# EAGLE design DonkeyBackpackM2R (EAGLE 5.11)
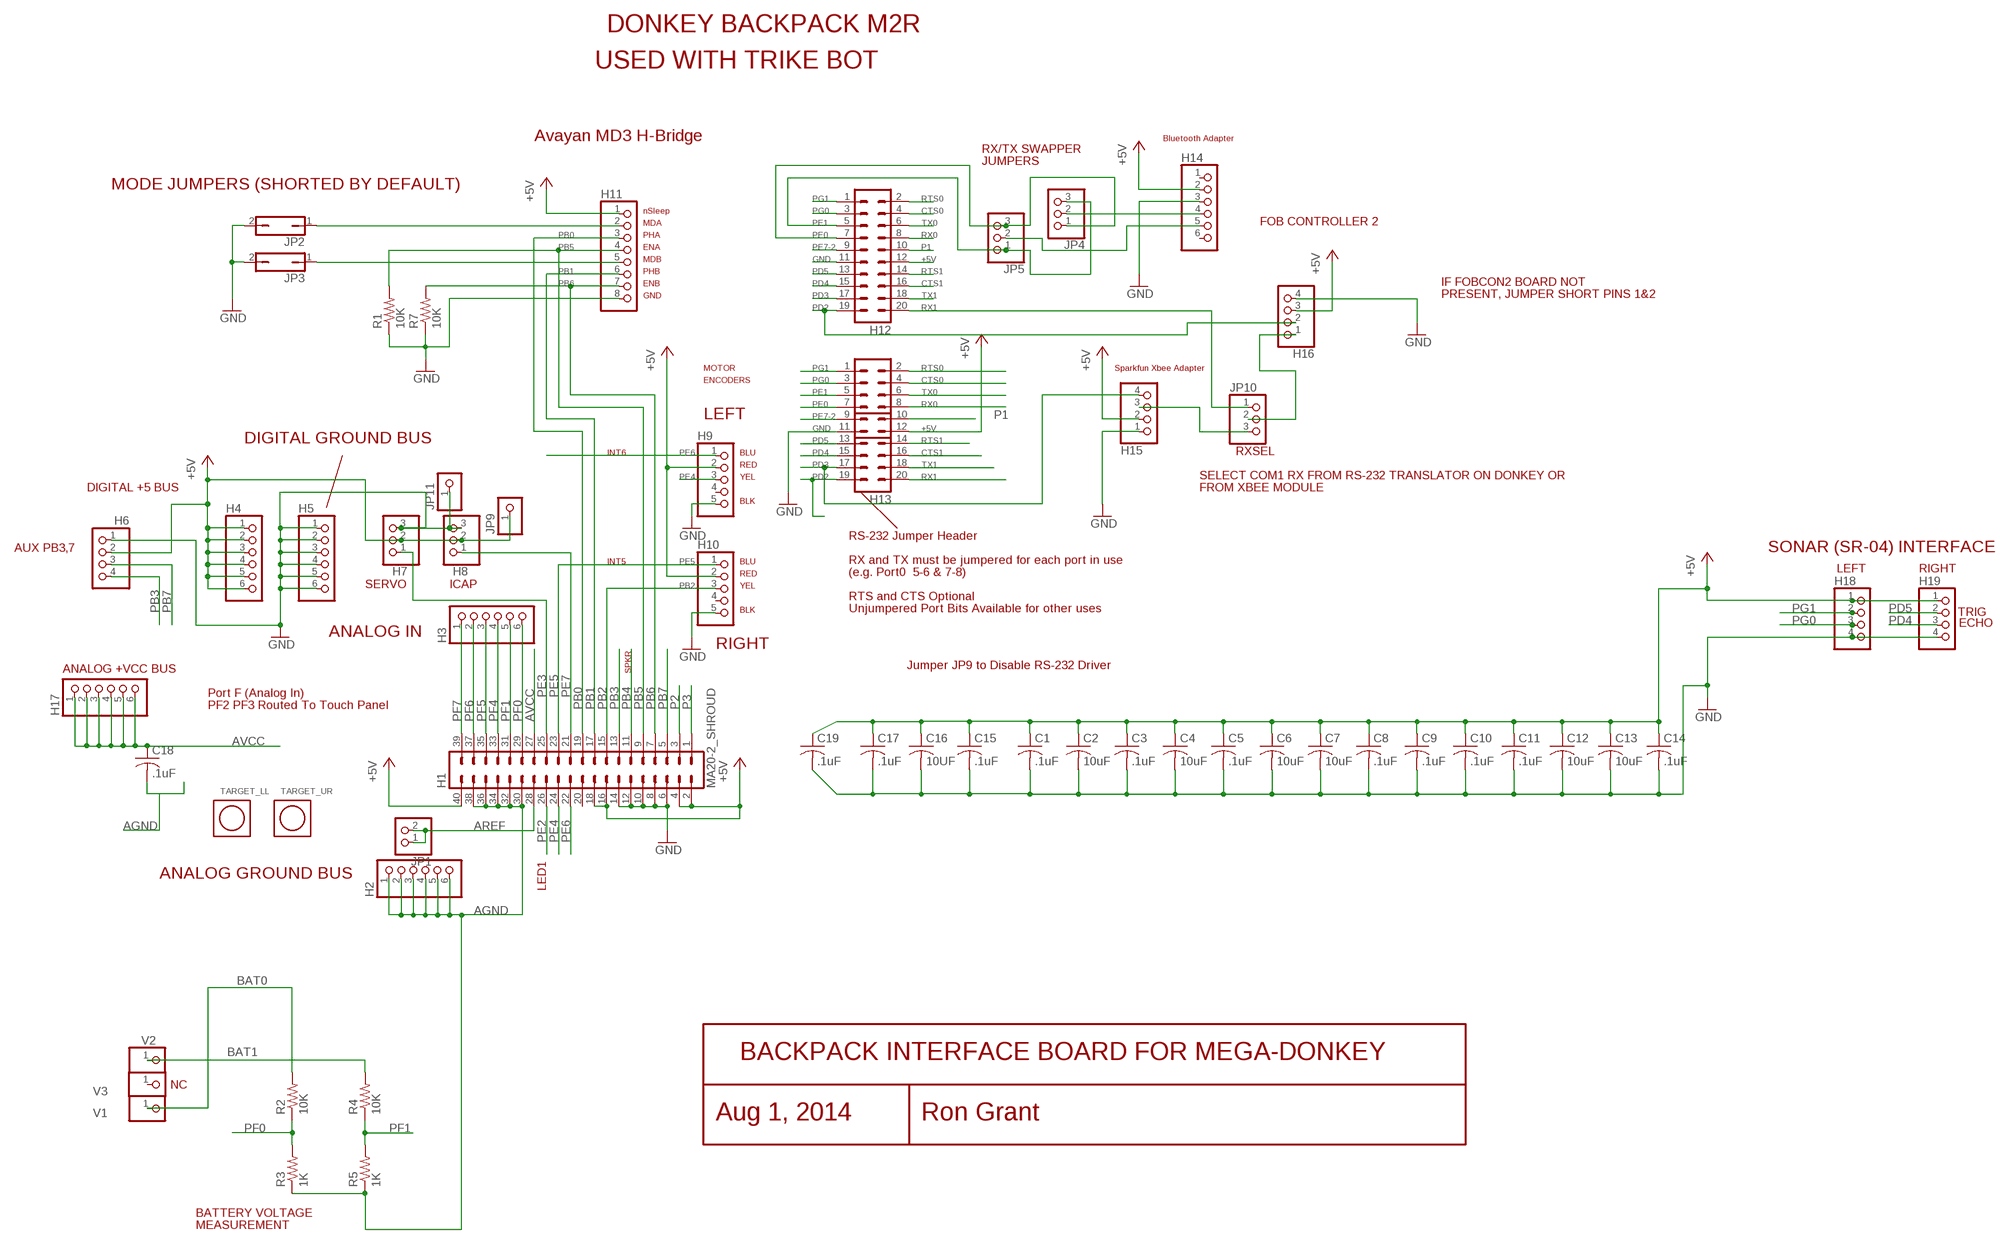
[diagram p0: schematic, sheet 1]

## Parts
C1  .1uF  C-USC0805  [C0805]
C2  10uF  C-USC0805  [C0805]
C3  .1uF  C-USC0805  [C0805]
C4  10uF  C-USC0805  [C0805]
C5  .1uF  C-USC0805  [C0805]
C6  10uF  C-USC0805  [C0805]
C7  10uF  C-USC0805  [C0805]
C8  .1uF  C-USC0805  [C0805]
C9  .1uF  C-USC0805  [C0805]
C10  .1uF  C-USC0805  [C0805]
C11  .1uF  C-USC0805  [C0805]
C12  10uF  C-USC0805  [C0805]
C13  10uF  C-USC0805  [C0805]
C14  .1uF  C-USC0805  [C0805]
C15  .1uF  C-USC0805  [C0805]
C16  10UF  C-USC0805  [C0805]
C17  .1uF  C-USC0805  [C0805]
C18  .1uF  C-USC0805  [C0805]
C19  .1uF  C-USC0805  [C0805]
H1  MA20-2_SHROUD  [MA20X2]
H2  PINHD-1X6  [1X06]
H3  PINHD-1X6  [1X06]
H4  PINHD-1X6  [1X06]
H5  PINHD-1X6  [1X06]
H6  PINHD-1X4  [1X04]
H7  PINHD-1X3  [1X03]
H8  PINHD-1X3  [1X03]
H9  PINHD-1X5  [1X05]
H10  PINHD-1X5  [1X05]
H11  PINHD-1X8  [1X08]
H12  MA10-2  [MA10-2]
H13  MA10-2  [MA10-2]
H14  PINHD-1X6  [1X06]
H15  PINHD-1X4  [1X04]
H16  PINHD-1X4  [1X04]
H17  PINHD-1X6  [1X06]
H18  PINHD-1X4  [1X04]
H19  PINHD-1X4  [1X04]
JP1  PINHD-1X2  [1X02]
JP2  JP1Q  [JP1]
JP3  JP1Q  [JP1]
JP4  PINHD-1X3  [1X03]
JP5  PINHD-1X3  [1X03]
JP9  PINHD-1X1  [1X01]
JP10  PINHD-1X3  [1X03]
JP11  PINHD-1X1  [1X01]
R1  10K  R-US_R0805  [R0805]
R2  10K  R-US_R0805  [R0805]
R3  1K  R-US_R0805  [R0805]
R4  10K  R-US_R0805  [R0805]
R5  1K  R-US_R0805  [R0805]
R7  10K  R-US_R0805  [R0805]
TARGET_LL  ALIGNMENT_TARGET_1MM  [1MM_ALIGNMENT_TARGET]
TARGET_UR  ALIGNMENT_TARGET_1MM  [1MM_ALIGNMENT_TARGET]
V1  PINHD-1X1  [1X01]
V2  PINHD-1X1  [1X01]
V3  PINHD-1X1  [1X01]

## Nets
+5V [VCC]: C1.1 C2.1 C3.1 C4.1 C5.1 C6.1 C7.1 C8.1 C9.1 C10.1 C11.1 C12.1 C13.1 C14.1 C15.1 C16.1 C17.1 C19.1 H1.2 H1.4 H1.16 H1.18 H1.40 H4.1 H4.2 H4.3 H4.4 H4.5 H4.6 H6.2 H7.2 H8.2 H9.2 H10.2 H11.1 H12.12 H13.12 H14.2 H15.2 H16.3 H18.1 H19.1 JP9.1
AGND: C18.2 H1.30 H1.32 H1.34 H1.36 H1.38 H2.1 H2.2 H2.3 H2.4 H2.5 H2.6 R3.1 R5.1
AREF: H1.28 JP1.1 JP1.2
AVCC: C18.1 H1.27 H17.1 H17.2 H17.3 H17.4 H17.5 H17.6
BAT0: R2.2 V1.1
BAT1: R4.2 V2.1
CTS0: H12.4 H13.4
CTS1: H12.16 H13.16
GND [GND]: C1.2 C2.2 C3.2 C4.2 C5.2 C6.2 C7.2 C8.2 C9.2 C10.2 C11.2 C12.2 C13.2 C14.2 C15.2 C16.2 C17.2 C19.2 H1.6 H1.8 H1.10 H1.12 H1.14 H5.1 H5.2 H5.3 H5.4 H5.5 H5.6 H6.1 H7.3 H8.3 H9.5 H10.5 H11.8 H12.11 H13.11 H14.3 H15.1 H16.4 H18.4 H19.4 JP2.2 JP3.2 JP11.1 R1.1 R7.1
N$1: H15.3 JP10.3
N$2: H11.2 JP2.1
N$3: H14.4 JP4.2
N$4: H14.5 JP5.2
N$5: H11.5 JP3.1
N$6: H16.1 JP10.2
P1: H12.10 H13.10
P2: H1.3
P3: H1.1
PB0: H1.19 H11.3
PB1: H1.17 H11.6
PB2: H1.15 H10.3
PB3: H1.13 H6.4
PB4: H1.11
PB5: H1.9 H11.4 R1.2
PB6: H1.7 H11.7 R7.2
PB7: H1.5 H6.3
PD2: H12.19 H13.19 H16.2
PD3: H12.17 H13.17 H15.4
PD4: H12.15 H13.15 H19.3
PD5: H12.13 H13.13 H19.2
PE0: H12.7 H13.7 JP4.1 JP5.3
PE1: H12.5 H13.5 JP4.3 JP5.1
PE2: H1.26
PE3: H1.25 H7.1
PE4: H1.24 H9.3
PE5: H1.23 H10.1
PE6: H1.22 H9.1
PE7: H1.21 H8.1
PE7-2: H12.9 H13.9
PF0: H1.29 H3.6 R2.1 R3.2
PF1: H1.31 H3.5 R4.1 R5.2
PF4: H1.33 H3.4
PF5: H1.35 H3.3
PF6: H1.37 H3.2
PF7: H1.39 H3.1
PG0: H12.3 H13.3 H18.3
PG1: H12.1 H13.1 H18.2
RTS0: H12.2 H13.2
RTS1: H12.14 H13.14
RX0: H12.8 H13.8
RX1: H12.20 H13.20 JP10.1
TX0: H12.6 H13.6
TX1: H12.18 H13.18
Unconnected: H1.20 H9.4 H10.4 H14.1 H14.6 V3.1

## Notes on the sheet
- DONKEY BACKPACK M2R
- USED WITH TRIKE BOT
- Avayan MD3 H-Bridge | Bluetooth Adapter
- RX/TX SWAPPER
- JUMPERS
- MODE JUMPERS (SHORTED BY DEFAULT)
- nSleep
- MDA | FOB CONTROLLER 2
- PHA
- ENA
- MDB
- PHB
- ENB | IF FOBCON2 BOARD NOT
- GND | PRESENT, JUMPER SHORT PINS 1&2
- MOTOR | Sparkfun Xbee Adapter
- ENCODERS
- LEFT
- DIGITAL GROUND BUS
- INT6 | BLU | RXSEL
- RED
- YEL | SELECT COM1 RX FROM RS-232 TRANSLATOR ON DONKEY OR
- DIGITAL +5 BUS | FROM XBEE MODULE
- BLK
- RS-232 Jumper Header
- AUX PB3,7 | SONAR (SR-04) INTERFACE
- INT5 | BLU | RX and TX must be jumpered for each port in use
- LEFT | RIGHT
- RED | (e.g. Port0  5-6 & 7-8)
- SERVO | ICAP | YEL
- RTS and CTS Optional
- BLK | Unjumpered Port Bits Available for other uses
- TRIG
- ECHO
- ANALOG IN
- RIGHT
- Jumper JP9 to Disable RS-232 Driver
- ANALOG +VCC BUS | SPKR
- Port F (Analog In)
- PF2 PF3 Routed To Touch Panel
- ANALOG GROUND BUS
- LED1
- BACKPACK INTERFACE BOARD FOR MEGA-DONKEY
- NC
- Aug 1, 2014 | Ron Grant
- BATTERY VOLTAGE
- MEASUREMENT

## Library data of the parts
C1-C19 = rcl:C-US: CAPACITOR, American symbol
H1 = 2_ronlib:MA20-2_SHROUD
H2-H5 H14 H17 = pinhead:PINHD-1X6: PIN HEADER
H6 H15 H16 H18 H19 = pinhead:PINHD-1X4: PIN HEADER
H7 H8 JP4 JP5 JP10 = pinhead:PINHD-1X3: PIN HEADER
H9 H10 = pinhead:PINHD-1X5: PIN HEADER
H11 = pinhead:PINHD-1X8: PIN HEADER
H12 H13 = con-lstb:MA10-2: PIN HEADER
JP1 = pinhead:PINHD-1X2: PIN HEADER
JP2 JP3 = jumper:JP1Q: JUMPER
JP9 JP11 V1-V3 = pinhead:PINHD-1X1: PIN HEADER
R1-R5 R7 = rcl:R-US_: RESISTOR, American symbol
TARGET_LL TARGET_UR = 2_ronlib:ALIGNMENT_TARGET_1MM

## Net classes
1 VCC: width 0.508 mm
2 GND: width 1.016 mm

## Board
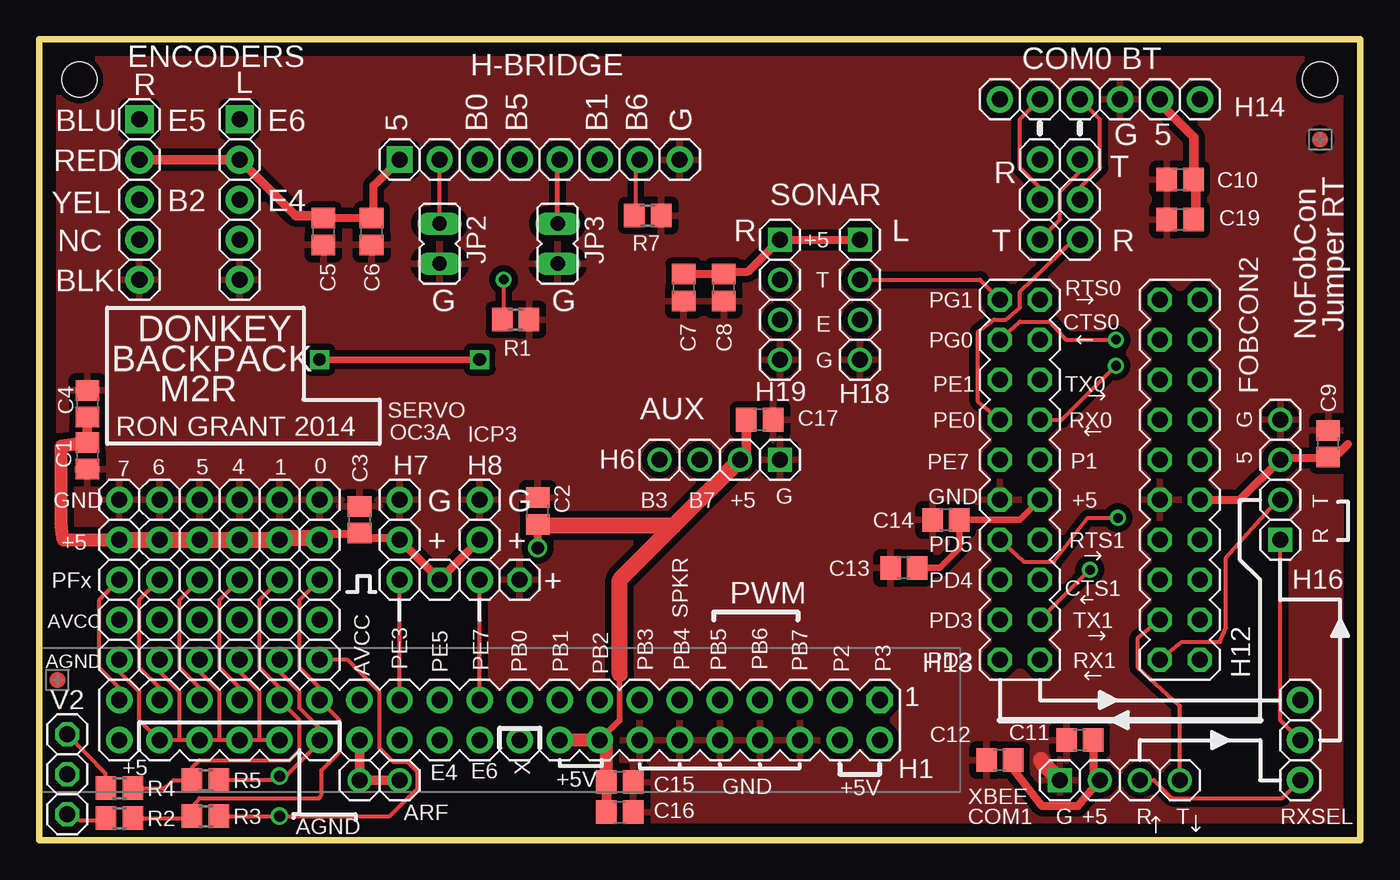
[diagram p1: board, top side]
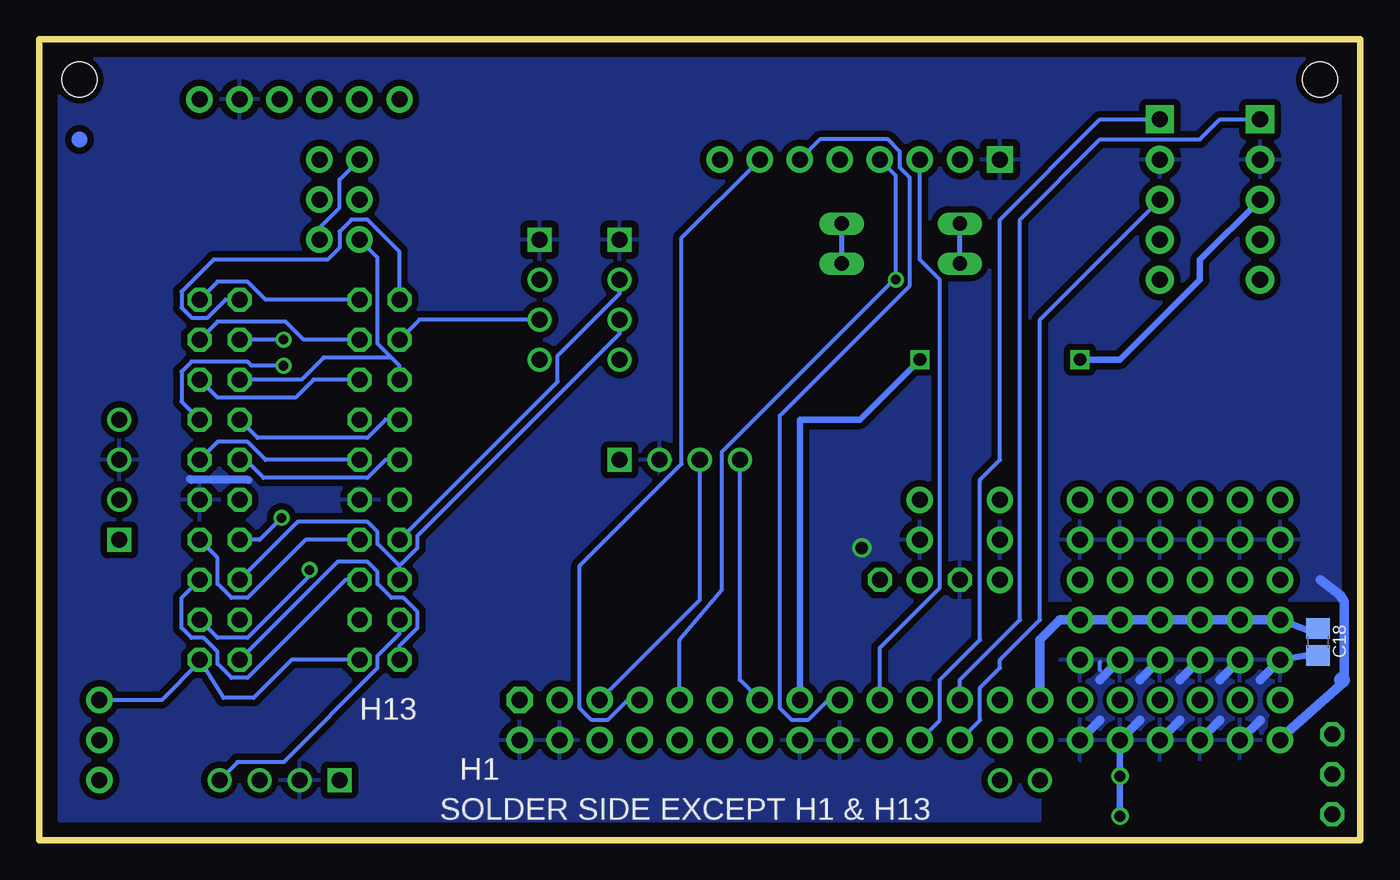
[diagram p2: board, bottom side, seen from below]

Size 83.82 x 50.8 mm. Coordinates in mm from the lower left corner, seen from the top.
Outline: 0,50.8 83.82,50.8 83.82,0 0,0 0,50.8
Copper layers (1*16): Top 0.035mm / dielectric 1.5mm / Bottom 0.035mm
Design rules "default *": minimum track width 10mil, minimum drill 24mil, track to track 10mil, track to pad 10mil, pad to pad 10mil, via to via 10mil, smd to smd 8mil, copper to edge 10mil, drill to drill 15mil, minimum pad ring 10mil, minimum via ring 8mil, stop-mask expansion 2.5mil, vias tented up to drill 0mil, thermal gap 18mil
Holes 2.2 mm at 81.28,48.26 2.54,48.26

### Footprints (pad centres in the part's own frame; a part is rotated, then mirrored left to right if it is on the bottom)
C0805 = smd 1.3 x 1.5: 1 -0.85,0; 2 0.85,0
MA20X2 = drill 1.016 pad 1.676 octagon: 1 -24.13,-1.27 | drill 1.016 pad 1.676 round: 2 -24.13,1.27; 3 -21.59,-1.27; 4 -21.59,1.27; 5 -19.05,-1.27; 6 -19.05,1.27; 7 -16.51,-1.27; 8 -16.51,1.27; 9 -13.97,-1.27; 10 -13.97,1.27; 11 -11.43,-1.27; 12 -11.43,1.27; 13 -8.89,-1.27; 14 -8.89,1.27; 15 -6.35,-1.27; 16 -6.35,1.27; 17 -3.81,-1.27; 18 -3.81,1.27; 19 -1.27,-1.27; 20 -1.27,1.27; 21 1.27,-1.27; 22 1.27,1.27; 23 3.81,-1.27; 24 3.81,1.27; 25 6.35,-1.27; 26 6.35,1.27; 27 8.89,-1.27; 28 8.89,1.27; 29 11.43,-1.27; 30 11.43,1.27; 31 13.97,-1.27; 32 13.97,1.27; 33 16.51,-1.27; 34 16.51,1.27; 35 19.05,-1.27; 36 19.05,1.27; 37 21.59,-1.27; 38 21.59,1.27; 39 24.13,-1.27; 40 24.13,1.27
1X06 = drill 1.016 pad 1.676 round: 1 -6.35,0; 2 -3.81,0; 3 -1.27,0; 4 1.27,0; 5 3.81,0; 6 6.35,0
1X04 = drill 1.016 square: 1 -3.81,0 | drill 1.016 round: 2 -1.27,0; 3 1.27,0; 4 3.81,0
1X03 = drill 1.016 pad 1.676 round: 1 -2.54,0; 2 0,0; 3 2.54,0
1X05 = drill 1.016 pad 1.778 square: 1 -5.08,0 | drill 1.016 pad 1.778 round: 2 -2.54,0; 3 0,0; 4 2.54,0; 5 5.08,0
1X08 = drill 1.016 pad 1.676 square: 1 -8.89,0 | drill 1.016 pad 1.676 round: 2 -6.35,0; 3 -3.81,0; 4 -1.27,0; 5 1.27,0; 6 3.81,0; 7 6.35,0; 8 8.89,0
MA10-2 = drill 1.016 octagon: 1 -11.43,-1.27; 2 -11.43,1.27; 3 -8.89,-1.27; 4 -8.89,1.27; 5 -6.35,-1.27; 6 -6.35,1.27; 7 -3.81,-1.27; 8 -3.81,1.27; 9 -1.27,-1.27; 10 -1.27,1.27; 11 1.27,-1.27; 12 1.27,1.27; 13 3.81,-1.27; 14 3.81,1.27; 15 6.35,-1.27; 16 6.35,1.27; 17 8.89,-1.27; 18 8.89,1.27; 19 11.43,-1.27; 20 11.43,1.27
1X02 = drill 1.016 round: 1 -1.27,0; 2 1.27,0
JP1 = drill 0.914 long: 1 0,-1.27; 2 0,1.27
1X01 = drill 1.016 octagon: 1 0,0
R0805 = smd 1.3 x 1.5: 1 -0.85,0; 2 0.85,0

### Placement (x,y rotation side)
C1  3.05,24.38 270 top
C2  31.62,20.88 90 top
C3  20.32,20.32 90 top
C4  3.05,27.69 90 top
C5  18.03,38.61 270 top
C6  21.08,38.61 270 top
C7  40.89,35.05 270 top
C8  43.43,35.05 270 top
C9  81.79,25.15 90 top
C10  72.39,41.91 180 top
C11  66.04,6.35 180 top
C12  60.96,5.08 180 top
C13  54.86,17.27 180 top
C14  57.53,20.32 180 top
C15  36.83,3.68 0 top
C16  36.83,1.78 0 top
C17  45.72,26.67 0 top
C18  2.67,12.57 270 bottom
C19  72.39,39.37 180 top
H1  29.21,7.62 180 top
H2  11.43,11.43 0 top
H3  11.43,16.51 0 top
H4  11.43,19.05 0 top
H5  11.43,21.59 0 top
H6  43.18,24.13 180 top
H7  22.86,19.05 90 top
H8  27.94,19.05 90 top
H9  12.7,40.64 270 top
H10  6.35,40.64 270 top
H11  31.75,43.18 0 top
H12  72.39,22.86 270 top
H13  62.23,22.86 270 top
H14  67.31,46.99 180 top
H15  68.58,3.81 0 top
H16  78.74,22.86 90 top
H17  11.43,13.97 0 top
H18  52.07,34.29 270 top
H19  46.99,34.29 270 top
JP1  21.59,3.81 180 top
JP2  25.4,37.85 180 top
JP3  32.89,37.85 180 top
JP4  66.04,40.64 90 top
JP5  63.5,40.64 90 top
JP9  25.4,16.51 0 top
JP10  80.01,6.35 270 top
JP11  30.48,16.51 0 top
R1  30.23,33.02 180 top
R2  5.08,1.4 180 top
R3  10.54,1.52 180 top
R4  5.08,3.3 180 top
R5  10.54,3.81 180 top
R7  38.61,39.62 180 top
TARGET_LL  1.14,10.16 0 top
TARGET_UR  81.28,44.45 0 top
V1  1.78,1.65 0 top
V2  1.78,6.73 0 top
V3  1.78,4.19 0 top

### Tracks (layer width: path | path; a pad name or v marks a point on that pad's centre or on a via)
+5V  (via drill 0.8)
  Top 0.356: 36.83,7.62 36.83,10.54
  Top 0.406: H13.12 62.23,20.32 C14.1 58.38,18.5 57.15,17.27 C13.1 | 61.85,5.08 C12.1 | H15.2 66.93,3.68 | H1.16 36.83,7.62 | C19.1 73.53,39.37 73.6,39.31
  Top 0.508: H11.1 21.21,41.53 21.21,39.62 C6.1 21.08,39.5 18.03,39.5 C5.1 17.91,39.62 | H8.2 JP9.1 H7.2 22.73,19.18 20.57,19.18 20.45,19.3 C3.1 20.32,19.43 18.16,19.43 H4.6 17.65,19.18 | H4.5 15.37,19.18 | H12.12 76.2,21.59 H16.3 78.87,24.26 81.79,24.26 C9.1 81.92,24.51 82.42,24.51 83.06,25.15 | 73.6,39.31 73.41,39.5 | C7.1 40.89,35.94 43.43,35.94 C8.1 43.56,36.07 44.96,36.07 H19.1 H18.1 | 31.88,19.94 C2.1 v31.62,18.54 | 61.85,5.08 61.85,4.45 63.63,2.16 65.91,2.16 H15.2 | 66.93,3.68 66.93,6.35 C11.1
  Top 0.61: H10.2 H9.2 16.26,39.62 17.91,39.62 | C16.1 C15.1 | C17.1 44.87,24.55 H6.2 | C1.1 C4.1 | H14.2 71.12,46.74 73.28,44.58 73.28,41.95 C10.1 73.41,41.74 73.41,39.5
  Top 0.813: H4.1 1.52,19.05 1.4,19.94 1.4,25.02 C1.1 | H1.18 H1.16 35.98,5.93 C15.1
  Top 1.016: H4.1 H4.2 H4.3 H4.4 H4.5 | 15.37,19.18 17.65,19.18 | 40.26,19.94 31.88,19.94 | 36.83,10.54 36.83,16.51 40.26,19.94 | 40.26,19.94 H6.2
  Bottom 0.508: 70.56,22.86 74.17,22.86 74.26,22.9 | 5.21,6.35 H1.40
  Bottom 0.61: 2.54,16.51 1.27,15.53 1.02,15.11 1.02,10.03 5.21,6.35
  pour Bottom (isolate 0.406): 20.32,1.27 20.32,15.24 1.27,15.24 1.27,49.53 82.55,49.53 82.55,1.27
AGND  (via drill 0.7)
  Top 0.254: R5.1 15.11,3.81 v15.24,4.06 15.62,4.06 17.78,6.22 H1.30 17.78,7.11 16.51,8.38 16.51,9.4 15.24,10.67 H2.5 | R3.1 v15.24,1.52 22.23,1.52 24,3.3 24,4.32 23.37,4.95 22.48,4.95 21.59,5.84 21.59,9.4 19.56,11.43 H2.6 | 8.89,6.35 H1.36 11.43,6.35 | 8.89,6.35 H1.38 6.35,7.62 6.35,9.4 5.08,10.67 H2.1 | 11.43,6.35 H1.34 13.97,6.35 | H1.32 13.97,6.35 | H2.2 7.62,10.67 8.89,9.4 8.89,6.35 | H2.3 10.16,10.67 11.43,9.4 11.43,6.35 | H2.4 12.7,10.67 13.97,9.4 13.97,6.35
  Bottom 0.254: 16.51,10.79 16.51,11.3
  Bottom 0.406: C18.2 3.56,11.68 H2.1 | H1.32 v15.24,4.06 v15.24,1.52
  Bottom 0.61: H1.38 6.35,7.62 | H1.36 8.89,7.62 | H1.34 11.43,7.62 | H1.32 13.97,7.62 | H1.30 16.51,7.62 | H2.1 6.35,10.16 | H2.2 8.89,10.16 | H2.3 11.43,10.16 | H2.4 13.97,10.16 | H2.5 16.51,10.16
  pour Bottom: 5.97,5.21 5.97,7.75 5.08,8.89 5.08,11.43 19.05,11.43 19.05,6.35 17.78,5.08
AREF
  Top 0.61: H1.28 JP1.2 JP1.1
AVCC
  Bottom 0.406: H17.1 3.43,13.34 C18.1
  Bottom 0.61: H17.6 H17.5 H17.4 | H17.6 H17.3 H17.2 H17.1 | H17.6 19.05,13.97 20.32,12.7 H1.27
BAT0
  Top 0.254: V1.1 2.03,1.78 2.54,1.27 4.1,1.27 R2.2
BAT1
  Top 0.254: V2.1 4.19,4.23 R4.2
CTS0
  Bottom 0.254: H13.4 67.06,31.75 68.2,32.89 72.52,32.89 H12.4
CTS1
  Bottom 0.254: H13.16 64.39,16.51 70.61,10.29 71.63,10.29 72.52,11.18 72.52,11.94 73.41,12.83 74.17,12.83 74.8,13.46 74.8,15.37 H12.16
GND
  Top 1.016: H15.1 63.63,4.95 63.59,5.08
  pour Top (isolate 0.406): 1.27,1.27 1.27,49.53 82.55,49.53 82.55,1.27
N$1
  Top 0.254: H15.3 70.74,3.81 71.88,2.67 78.87,2.67 JP10.3
N$2
  Top 0.254: JP2.1 H11.2
  Bottom 0.305: 25.4,36.45 JP2.1
N$3
  Top 0.254: JP4.2 66.04,41.4 67.31,42.67 67.31,45.72 H14.4
N$4
  Top 0.254: JP5.2 63.5,41.4 62.23,42.67 62.23,45.72 H14.5
N$5
  Top 0.305: JP3.1 32.89,43.18 H11.5
  Bottom 0.305: 32.89,36.45 JP3.1
N$6
  Top 0.254: H16.1 78.74,7.62 JP10.2
P1
  Bottom 0.254: H13.10 69.47,24.13 70.61,25.27 72.52,25.27 H12.10
PB0
  Bottom 0.254: H1.19 30.48,12.19 26.67,16 26.67,35.56 27.94,36.83 H11.3
PB1
  Bottom 0.254: H1.17 33.78,8.89 35.05,7.62 36.07,7.62 36.83,8.38 36.83,26.92 28.57,35.18 28.57,42.04 29.21,42.67 29.21,43.69 29.97,44.45 34.29,44.45 H11.6
PB2  (via drill 0.8, 0.8 pad 0.61)
  Top 0.406: v27.94,30.48 v17.78,30.48
  Bottom 0.406: H1.15 35.56,26.67 31.75,26.67 v27.94,30.48 | v17.78,30.48 15.24,30.48 10.16,35.56 10.16,36.83 H10.3
PB3
  Bottom 0.254: H6.4 39.37,10.16 H1.13
PB5  (via drill 0.61)
  Top 0.254: v29.46,35.56 29.46,33.02 R1.2
  Bottom 0.254: 29.46,35.69 29.46,42.16 H11.4 | H1.9 43.18,12.7 40.51,15.88 40.51,24.64 29.46,35.69 | 29.46,35.69 v29.46,35.56
PB6
  Top 0.254: H11.7 37.85,42.93 37.85,39.62 R7.2
  Bottom 0.254: H1.7 46.48,8.89 47.75,7.62 48.77,7.62 49.53,8.38 49.53,17.4 43.05,23.88 43.05,38.23 H11.7
PB7
  Bottom 0.254: H1.5 41.91,15.24 H6.3
PD2
  Top 0.254: H16.2 78.36,21.34 75.31,17.91 75.31,13.46 74.93,12.57 72.52,12.57 H12.19
  Bottom 0.254: H13.19 60.96,12.32 59.82,13.46 59.82,14.48 60.71,15.37 61.47,15.37 62.36,16.26 62.36,17.02 62.99,17.65 64.9,17.65 H12.19
PD3
  Top 0.254: H15.4 72.39,8.51 69.72,10.92 69.72,12.83 H12.17
  Bottom 0.254: H13.17 60.96,13.08 62.36,11.68 62.36,10.92 68.33,4.95 71.25,4.95 H15.4
PD4
  Bottom 0.254: H13.15 60.96,17.4 | 60.96,17.4 62.36,18.8 62.36,19.56 62.99,20.19 67.44,20.19 H12.15 | H19.3 46.99,32.13 59.82,19.3 59.82,18.54 60.96,17.4
PD5  (via drill 0.61)
  Top 0.254: v68.45,20.45 66.55,20.45 64.39,17.65 62.48,17.65 H13.13
  Bottom 0.254: H19.2 46.99,34.67 50.93,30.73 50.93,29.08 H13.13 | H12.13 69.85,19.05 v68.45,20.45
PE0
  Top 0.254: JP4.1 65.66,38.1 62.23,34.8 62.23,33.78 61.34,33.02 60.58,33.02 59.56,32.26 59.56,27.81 H13.7
  Bottom 0.254: JP4.1 66.04,38.86 64.77,40.13 64.77,41.91 JP5.3 | H13.7 61.85,26.67 62.99,25.53 69.98,25.53 H12.7
PE1
  Top 0.254: JP4.3 66.04,42.42 64.77,41.15 64.77,39.37 JP5.1
  Bottom 0.254: H13.5 60.96,30.1 61.53,30.67 | 61.53,30.67 62.36,31.5 62.36,36.96 JP5.1 | H12.5 67.18,29.21 65.79,30.61 61.59,30.61 61.53,30.67
PE3
  Top 0.254: H1.25 H7.1
PE4
  Bottom 0.254: H9.3 20.32,33.02 20.32,13.97 22.86,11.43 22.86,10.92 24.13,9.65 24.13,7.62 H1.24
PE5
  Bottom 0.254: H10.1 8.89,45.72 10.16,44.45 16.51,44.45 21.59,39.37 21.59,13.97 25.4,10.16 H1.23
PE6
  Bottom 0.254: H9.1 16.51,45.72 22.86,39.37 22.86,24.13 24.13,22.86 24.13,12.7 26.67,10.16 26.67,7.62 H1.22
PE7
  Top 0.254: H1.21 H8.1
PE7-2
  Bottom 0.254: H13.9 61.85,24.13 62.99,22.99 69.6,22.99 70.74,24.13 H12.9
PF0
  Top 0.254: H3.6 16.51,15.24 16.51,10.92 17.78,9.65 H1.29 19.05,7.62 19.05,5.59 17.91,4.45 17.91,2.92 17.78,2.67 10.16,2.67 9.69,2.07 R3.2 9.56,1.4 R2.1
PF1
  Top 0.254: H3.5 13.97,15.24 13.97,10.92 15.24,9.65 H1.31 16.51,7.62 16.51,5.71 15.88,5.08 10.16,5.08 9.69,4.61 R5.2 8.51,3.81 7.87,3.3 R4.1
PF4
  Top 0.254: H3.4 11.43,15.24 11.43,10.92 12.7,9.65 H1.33
PF5
  Top 0.254: H3.3 8.89,15.24 8.89,10.92 10.16,9.65 H1.35
PF6
  Top 0.254: H3.2 6.35,15.24 6.35,10.92 7.62,9.65 H1.37
PF7
  Top 0.254: H3.1 3.81,15.24 3.81,10.92 5.08,9.65 H1.39
PG0  (via drill 0.61)
  Top 0.254: v68.33,31.75 65.15,31.75 64.14,32.89 62.23,32.89 H13.3
  Bottom 0.254: H18.3 59.69,33.02 H13.3 | v68.33,31.75 H12.3
PG1
  Top 0.254: H18.2 59.69,35.56 H13.1
  Bottom 0.254: H12.1 72.01,34.29 73.15,33.15 74.17,33.15 74.8,33.78 74.8,34.8 72.77,36.83 65.53,36.83 64.77,37.59 64.77,38.61 64.01,39.37 62.99,39.37 60.96,37.34 H13.1
RTS0
  Bottom 0.254: H13.2 69.47,34.29 70.61,35.43 72.52,35.43 H12.2
RTS1
  Bottom 0.254: H13.14 66.93,19.05 70.61,15.37 71.63,15.37 72.52,16.26 72.52,17.91 H12.14
RX0  (via drill 0.61)
  Top 0.254: H13.8 64.9,26.67 v68.33,30.1
  Bottom 0.254: v68.33,30.1 70.36,30.1 70.61,30.35 74.17,30.35 74.8,29.72 74.8,27.81 H12.8
RX1
  Bottom 0.254: H13.20 67.82,11.43 70.23,9.02 72.14,9.02 H12.20 73.66,11.3 76.07,8.89 JP10.1
TX0
  Bottom 0.254: H13.6 66.42,29.21 67.56,28.07 72.52,28.07 H12.6
TX1  (via drill 0.61)
  Top 0.254: H13.18 v66.67,17.14
  Bottom 0.254: v66.67,17.14 66.67,16.76 70.61,12.83 72.52,12.83 H12.18

### Text on the board
tPlace: H-BRIDGE | ENCODERS | COM0 BT | R | L | BLU | E5 | E6 | 5 | B0 | B5 | B1 | B6 | G | G | 5 | RED | R | T | YEL | B2 | E4 | SONAR | R | +5 | L | NC | T | R | BLK | T | RTS0 | G | G | PG1 | DONKEY | E | CTS0 | NoFobCon | Jumper RT | PG0 | BACKPACK | G | PE1 | M2R | TX0 | FOBCON2 | SERVO | AUX | RON GRANT 2014 | PE0 | RX0 | G | OC3A | ICP3 | 7 | 6 | 5 | 4 | 1 | 0 | PE7 | P1 | 5 | B3 | B7 | +5 | GND | G | G | G | GND | +5 | T | RTS1 | R | +5 | + | + | PD5 | PFx | + | PD4 | PWM | CTS1 | AVCC | SPKR | AVCC | PD3 | TX1 | PD2 | AGND | PE3 | PE5 | PE7 | PB0 | PB1 | PB2 | PB3 | PB4 | PB5 | PB6 | PB7 | P2 | P3 | RX1 | +5 | E4 | E6 | X | +5V | GND | +5V | XBEE | ARF | COM1 | G | +5 | R | T | RXSEL | AGND
bPlace: H13 | H1 | SOLDER SIDE EXCEPT H1 & H13